# Altium schematic sheet RF.SchDoc
size A
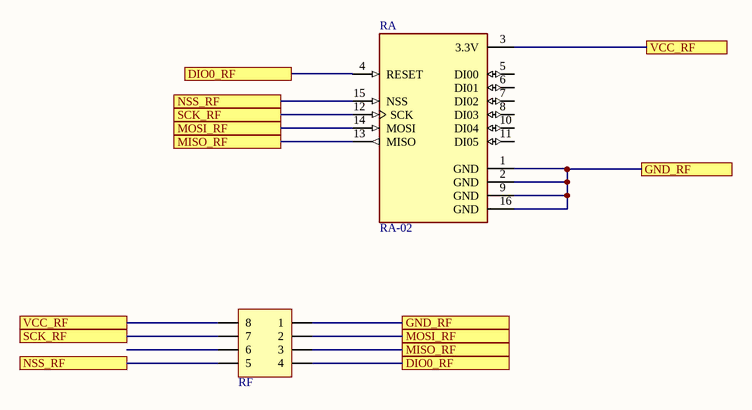
[diagram p0: RF.SchDoc]

## Parts
RA  RA-02  [RA-02]
RF  JP 2x4 2.54  [JP 2x4 DT]  (value not drawn)

## Ports
DIO0_RF, GND_RF, MISO_RF, MOSI_RF, NSS_RF, SCK_RF, VCC_RF

## Nets
DIO0_RF: RA.4(RESET) RF.4 ; port DIO0_RF
GND_RF: RA.1(GND) RA.2(GND) RA.9(GND) RA.16(GND) RF.1 ; port GND_RF
MISO_RF: RA.13(MISO) RF.3 ; port MISO_RF
MOSI_RF: RA.14(MOSI) RF.2 ; port MOSI_RF
NSS_RF: RA.15(NSS) RF.5 ; port NSS_RF
SCK_RF: RA.12(SCK) RF.7 ; port SCK_RF
VCC_RF: RA.3(3.3V) RF.8 ; port VCC_RF

Not connected (* = marked no-connect by the designer): RA 5(DI00) 6(DI01) 7(DI02) 8(DI03) 10(DI04) 11(DI05); RF 6

## Library data of the parts
RA = RA-02: General ISM < 1GHz LoRaâ„¢ Transceiver Module 410MHz ~ 525MHz Antenna Not Included, I-PEX Surface Mount; MF: Ai-Thinker; Package: None; Price: None; Value: *; SnapEDA_Link: https://www.snapeda.com/parts/RA-02/AI-Thinker/view-part/?ref=snap; MP: RA-02; Availability: Not in stock; Check_prices: https://www.snapeda.com/parts/RA-02/AI-Thinker/view-part/?ref=eda
RF = JP 2x4 2.54 Duc Thang: Cắm; Ten_Linh_Kien: Jump Đôi Đực 2.54MM 2x40P Thẳng 11MM; Don_Vi: Con; Ma_Hang: MH002686; Ghi_Chu: *; Kieu_Chan: *; Chung_Loai: Cắm